# Altium schematic sheet CH340E5T-R0.SchDoc
size 165 x 165 mm; SheetNumber: 0; SheetTotal: 0
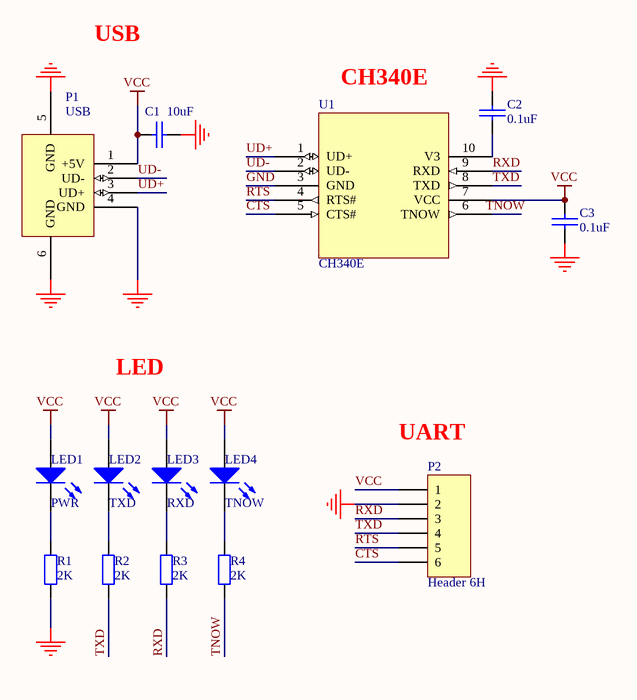
[diagram p0: CH340E5T-R0.SchDoc]

## Parts
C1  10uF  [3216_C]
C2  0.1uF  [0603_C]
C3  0.1uF  [0603_C]
LED1  PWR  [0603+]
LED2  TXD  [0603+]
LED3  RXD  [0603+]
LED4  TNOW  [0603+]
P1  USB  [USBAM]
P2  Header 6H  [SIP6-2.54mm]
R1  2K  [0603]
R2  2K  [0603]
R3  2K  [0603]
R4  2K  [0603]
U1  CH340E  [MSOP10]

## Nets
GND: C1.2 C2.2 C3.2 P1.4(GND) P1.5(GND) P1.6(GND) P2.2 R1.2 U1.3(GND)
VCC: C1.1 C3.1 LED1.1(A) LED2.1(A) LED3.1(A) LED4.1(A) P1.1(+5V) P2.1 U1.7(VCC)
CTS: P2.6 U1.5(CTS#)
RTS: P2.5 U1.4(RTS#)
RXD: P2.3 R3.2 U1.9(RXD)
TNOW: R4.2
TXD: P2.4 R2.2 U1.8(TXD)
UD+: P1.3(UD+) U1.1(UD+)
UD-: P1.2(UD-) U1.2(UD-)
NetC2_1: C2.1 U1.10(V3)
NetLED1_2: LED1.2(K) R1.1
NetLED2_2: LED2.2(K) R2.1
NetLED3_2: LED3.2(K) R3.1
NetLED4_2: LED4.2(K) R4.1

Not connected (* = marked no-connect by the designer): U1 6(TNOW)

## Notes on the sheet
- USB
- CH340E
- LED
- (near P2) UART
- Labels drawn without touching a wire or pin: TNOW

## Library data of the parts
C1-C3 = CAP: Capacitor
LED1-LED4 = LED2: Typical RED, GREEN, YELLOW, AMBER GaAs LED
P2 = Header 6H: Header, 6-Pin, Right Angle; LatestRevisionDate: 17-Jul-2002; LatestRevisionNote: Re-released for DXP Platform.; Publisher: Altium Limited
R1-R4 = Res2: Resistor
U1 = CH340E: USB to TTL Serial / UART